# Altium project PCB_INSTRUMENTATION_VSOURCE.PrjPcb
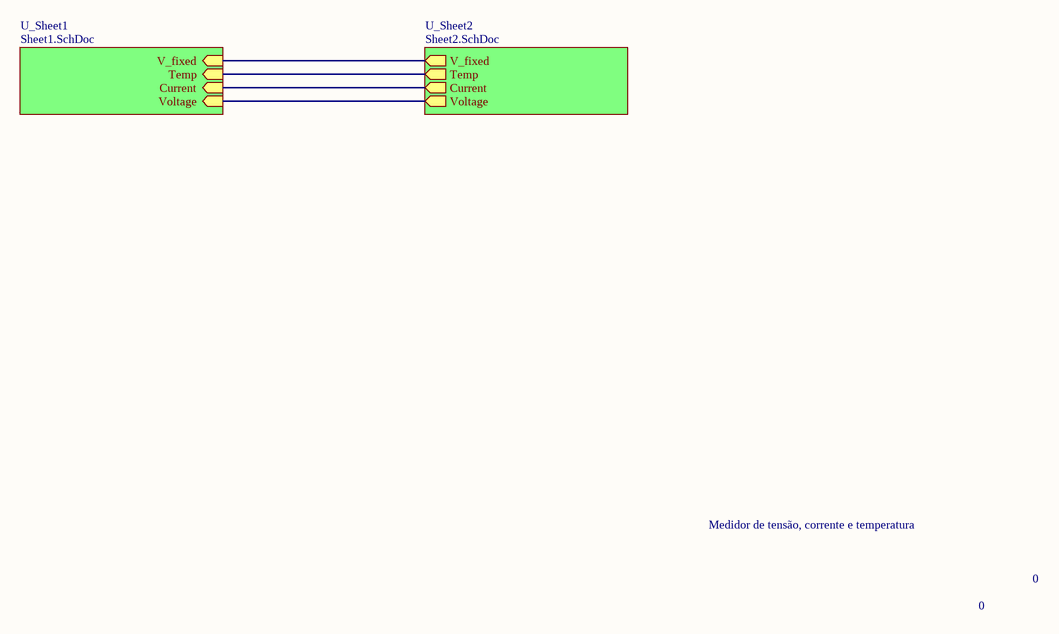
[diagram p0: main.SchDoc]
3 sheets, 53 parts. Net scope: hierarchical (ports join the sheet entries above them; power ports are global).
Board file: PCB_INST_FONTE.PcbDoc
Sheets:
  main.SchDoc
    U_Sheet1 = Sheet1.SchDoc
    U_Sheet2 = Sheet2.SchDoc

## Sheet main.SchDoc
size A4

### Sub-sheets
U_Sheet1 = Sheet1.SchDoc: V_fixed (in), Temp (in), Current (in), Voltage (in)
U_Sheet2 = Sheet2.SchDoc: V_fixed (out), Temp (out), Current (out), Voltage (out)

### Nets
NetC14_1: sheet U_Sheet1/Voltage, sheet U_Sheet2/Voltage
NetC15_1: sheet U_Sheet1/V_fixed, sheet U_Sheet2/V_fixed
NetC16_1: sheet U_Sheet1/Current, sheet U_Sheet2/Current
NetC17_1: sheet U_Sheet1/Temp, sheet U_Sheet2/Temp

### Notes on the sheet
- Medidor de tensão, corrente e temperatura
- 0

## Sheet Sheet1.SchDoc
size A4
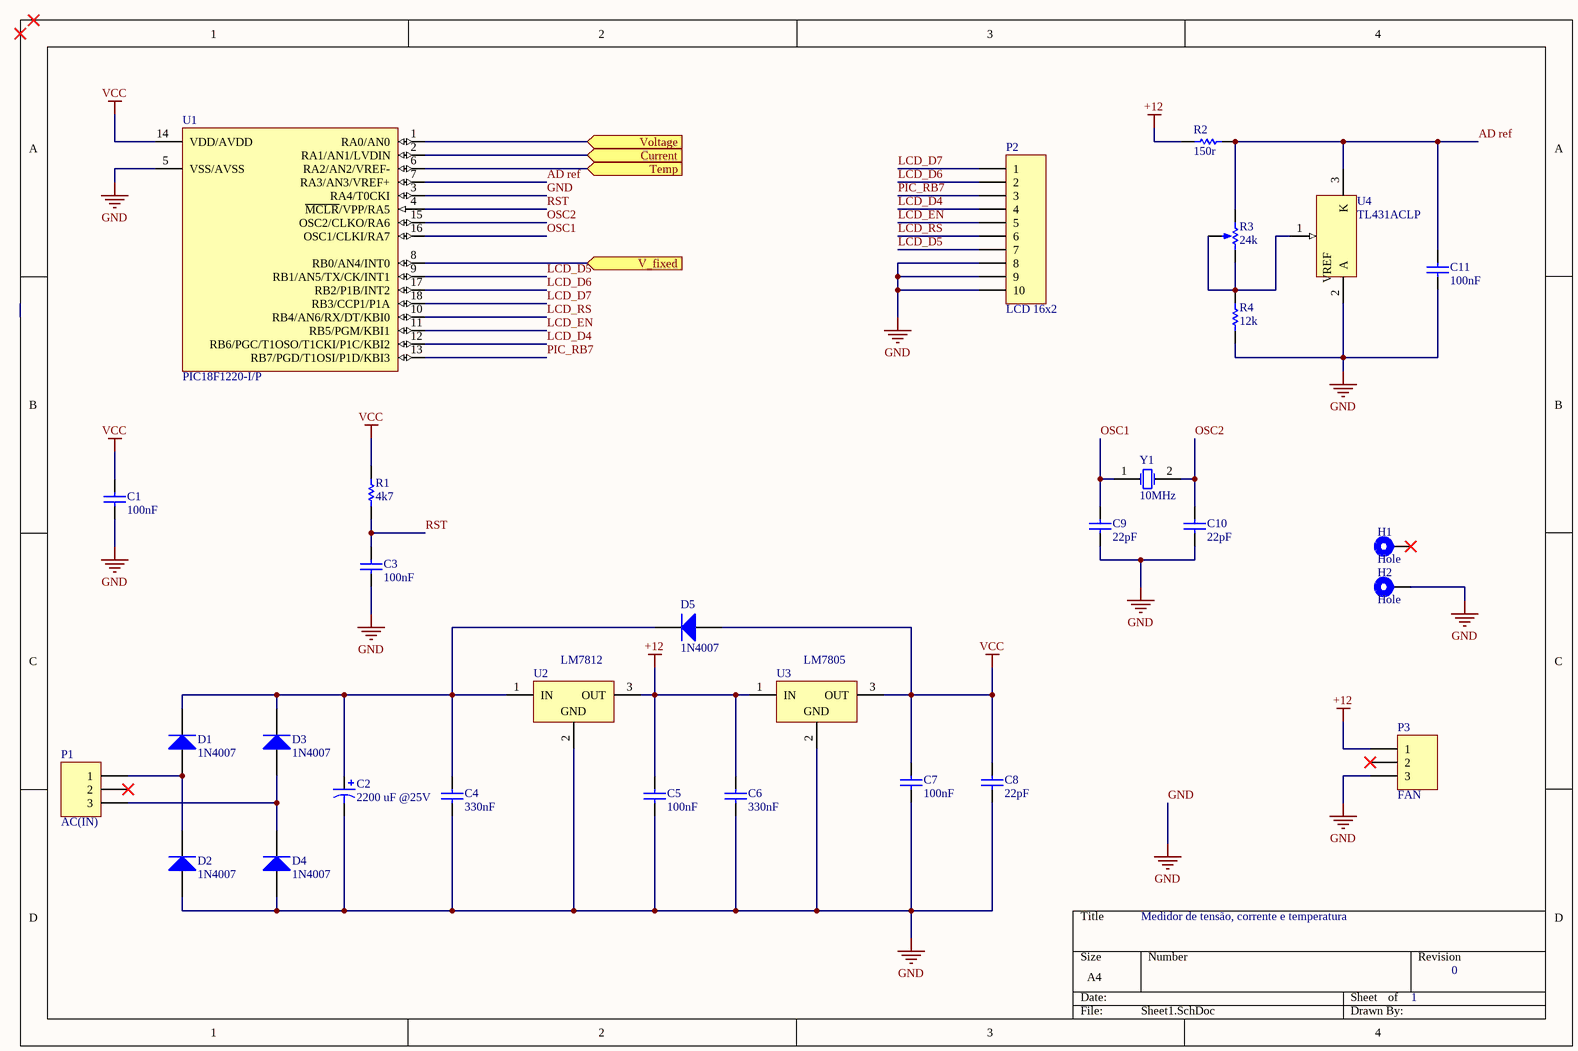
[diagram p1: Sheet1.SchDoc]

### Parts
C1  100nF  [RAD-0.2]
C2  2200 uF @25V  [CAPPR5-13x21]
C3  100nF  [RAD-0.2]
C4  330nF  [RAD-0.2]
C5  100nF  [RAD-0.2]
C6  330nF  [RAD-0.2]
C7  100nF  [RAD-0.2]
C8  22pF  [RAD-0.2]
C9  22pF  [RAD-0.2]
C10  22pF  [RAD-0.2]
C11  100nF  [RAD-0.2]
D1  1N4007  [DIODE-1N400X]
D2  1N4007  [DIODE-1N400X]
D3  1N4007  [DIODE-1N400X]
D4  1N4007  [DIODE-1N400X]
D5  1N4007  [DO-41]
H1  Hole  [HOLE_M3]
H2  Hole  [HOLE_M3]
P1  AC(IN)  [HDR1X3]
P2  LCD 16x2  [HDR1X10]
P3  FAN  [HDR1X3]
R1  4k7  [AXIAL-0.4]
R2  150r  [AXIAL-0.4]
R3  24k  [VR1]
R4  12k  [AXIAL-0.4]
U1  PIC18F1220-I/P  [PDIP300-P18]
U2  LM7812  [T03B]
U3  LM7805  [T03B]
U4  TL431ACLP  [LP03]
Y1  10MHz  [CRYSTAL-HC49S]

### Ports
Current (in), Temp (in), V_fixed (in), Voltage (in)

### Nets
+12: C5.1 C6.1 P3.1 R2.1 U2.3(OUT) U3.1(IN)
GND: C1.2 C2.2 C3.2 C4.2 C5.2 C6.2 C7.2 C8.1 C9.1 C10.1 C11.2 D2.1(A) D4.1(A) H2.1 P2.8 P2.9 P2.10 P3.3 R4.1 U1.3(RA4/T0CKI) U1.5(VSS/AVSS) U2.2(GND) U3.2(GND) U4.2(A)
VCC: C1.1 C7.1 C8.2 D5.1(A) R1.2 U1.14(VDD/AVDD) U3.3(OUT)
AD ref: C11.1 R2.2 R3.1(TOP) U1.7(RA3/AN3/VREF+) U4.3(K)
LCD_D4: P2.4 U1.12(RB6/PGC/T1OSO/T1CKI/P1C/KBI2)
LCD_D5: P2.7 U1.9(RB1/AN5/TX/CK/INT1)
LCD_D6: P2.2 U1.17(RB2/P1B/INT2)
LCD_D7: P2.1 U1.18(RB3/CCP1/P1A)
LCD_EN: P2.5 U1.11(RB5/PGM/KBI1)
LCD_RS: P2.6 U1.10(RB4/AN6/RX/DT/KBI0)
OSC1: C9.2 U1.16(OSC1/CLKI/RA7) Y1.1(OSC1)
OSC2: C10.2 U1.15(OSC2/CLKO/RA6) Y1.2(OSC2)
PIC_RB7: P2.3 U1.13(RB7/PGD/T1OSI/P1D/KBI3)
RST: C3.1 R1.1 U1.4(~{MCLR}/VPP/RA5)
NetC2_1: C2.1 C4.1 D1.2(K) D3.2(K) D5.2(K) U2.1(IN)
NetC14_1: U1.1(RA0/AN0) ; port Voltage
NetC15_1: U1.8(RB0/AN4/INT0) ; port V_fixed
NetC16_1: U1.2(RA1/AN1/LVDIN) ; port Current
NetC17_1: U1.6(RA2/AN2/VREF-) ; port Temp
NetD1_1: D1.1(A) D2.2(K) P1.1
NetD3_1: D3.1(A) D4.2(K) P1.3
NetR3_2: R3.2(BOT) R3.3(TAP) R4.2 U4.1(VREF)

Not connected (* = marked no-connect by the designer): H1 1*; P1 2*; P3 2*

### Notes on the sheet
- Medidor de tensão, corrente e temperatura
- 1
- 0

### Library data of the parts
C1 C3-C11 = C: Capacitor; Value: 1; Manufacturer: *; PartNumber: *; Package Type: *
C2 = CP: Polarized Capacitor; Manufacturer: *; PartNumber: *; Package Type: *; Value: *
D1-D4 = D: Diode; Manufacturer: *; PartNumber: *; Package Type: *
D5 = Diode 1N4007: 1 Amp General Purpose Rectifier; Published: 8-Jun-2000; LatestRevisionDate: 17-Jul-2002; LatestRevisionNote: Re-released for DXP Platform.; DatasheetVersion: 1998; PackageVersion: Aug-1999; PackageReference: DO-41; Publisher: Altium Limited; PackageDescription: Diode, Axial; Body 5.2 x 2.7 mm (LxDia. max), Lead Dia. 0.86 mm (max); Code_JEDEC: DO-204-AL; ComponentLink1Description: Manufacturer Link; ComponentLink1URL: http://www.fairchildsemi.com/; ComponentLink2Description: Datasheet; ComponentLink2URL: http://www.fairchildsemi.com/ds/1N%2F1N4001.pdf
P1 P3 = Header 3: Header, 3-Pin; LatestRevisionDate: 17-Jul-2002; LatestRevisionNote: Re-released for DXP Platform.; Publisher: Altium Limited
P2 = Header 10: Header, 10-Pin; LatestRevisionDate: 17-Jul-2002; LatestRevisionNote: Re-released for DXP Platform.; Publisher: Altium Limited
R1 R2 R4 = R: Resistor; Value: 0; Manufacturer: *; PartNumber: *; Package Type: *
R3 = R Pot: Potentiometer; Manufacturer: *; PartNumber: *; Package Type: *; Value: *; Set Position: *
U1 = PIC18F1220-I/P: High Performance, Enhanced Flash Microcontroller with 10-Bit A/D and nanoWatt Technology, 4K Flash, 18-Pin PDIP, Industrial Temperature; Published: 11-Oct-2004; LatestRevisionDate: 29-Jan-2009; LatestRevisionNote: Sch. layout revised. 3D Model Removed.; DatasheetVersion: revF, Feb-2007; PackageVersion: revBB, Aug-2009; PackageReference: PDIP300-P18; Publisher: Altium Limited; PackageDescription: 18-Lead Plastic Dual In-Line (P) - 300 mil Body [PDIP]; Supplier 1: Digi-Key; Supplier Part Number 1: PIC18F1220-I/P-ND; Supplier 2: Farnell; Supplier Part Number 2: 9761977; Supplier 3: Farnell; Supplier Part Number 3: 9771450; Code_JEDEC: MS-001; ComponentLink1Description: Datasheet; ComponentLink1URL: http://ww1.microchip.com/downloads/en/DeviceDoc/39605F.pdf; ComponentLink2Description: Packaging Specification; ComponentLink2URL: http://www.microchip.com/stellent/groups/techpub_sg/documents/packagingspec/en012702.pdf; ComponentLink3Description: Microchip.com Home; ComponentLink3URL: http://www.microchip.com/
U2 U3 = LM7808CT: Series 3-Terminal Positive Regulators, 3-pin TO-220; Manufacturer: National Semiconductor; PackageTopMarking: NSUZXYTTE#*LM7808CT; CompType: LDO IC; Published: 4-Dec-2008; DatasheetVersion: Jul-2006; PackageVersion: revL, Jan-1992; PackageReference: T03B; Publisher: Altium Limited; PackageDescription: TO-220, Molded, 3 Lead, Straight; Supplier 1: Farnell; Supplier Part Number 1: 9490248; PartNumber: LM7808CT; RoHS: O; PinCount: 3; ComponentLink1Description: LM340 Datasheet; ComponentLink1URL: http://www.national.com/ds/LM/LM340.pdf; ComponentLink2Description: LM340 Web Page; ComponentLink2URL: http://www.national.com/pf/LM/LM340.html; ComponentLink3Description: T03B Package Page; ComponentLink3URL: http://www.national.com/packaging/folders/t03b.html
U4 = TL431ACLP: Adjustable Precision Shunt Regulator; Published: 15-Apr-2002; LatestRevisionDate: 06-Jun-2005; LatestRevisionNote: Sch pins 1 & 3 swapped; DatasheetVersion: Oct-2000; PackageVersion: Nov-2001; PackageReference: LP03; Publisher: Altium Limited; PackageDescription: TO, Flat Index; 3 In-Line, Axial Leads; Body Dia. 4.8mm; Leads 0.56 x 0.41 mm (max); Code_JEDEC: TO-226-AA; ComponentLink1Description: Manufacturer Link; ComponentLink1URL: http://www.ti.com/; ComponentLink2Description: Datasheet; ComponentLink2URL: http://www-s.ti.com/sc/ds/tl431a.pdf
Y1 = XTAL: Crystal Oscillator; Manufacturer: *; PartNumber: *; Package Type: *

## Sheet Sheet2.SchDoc
size A4
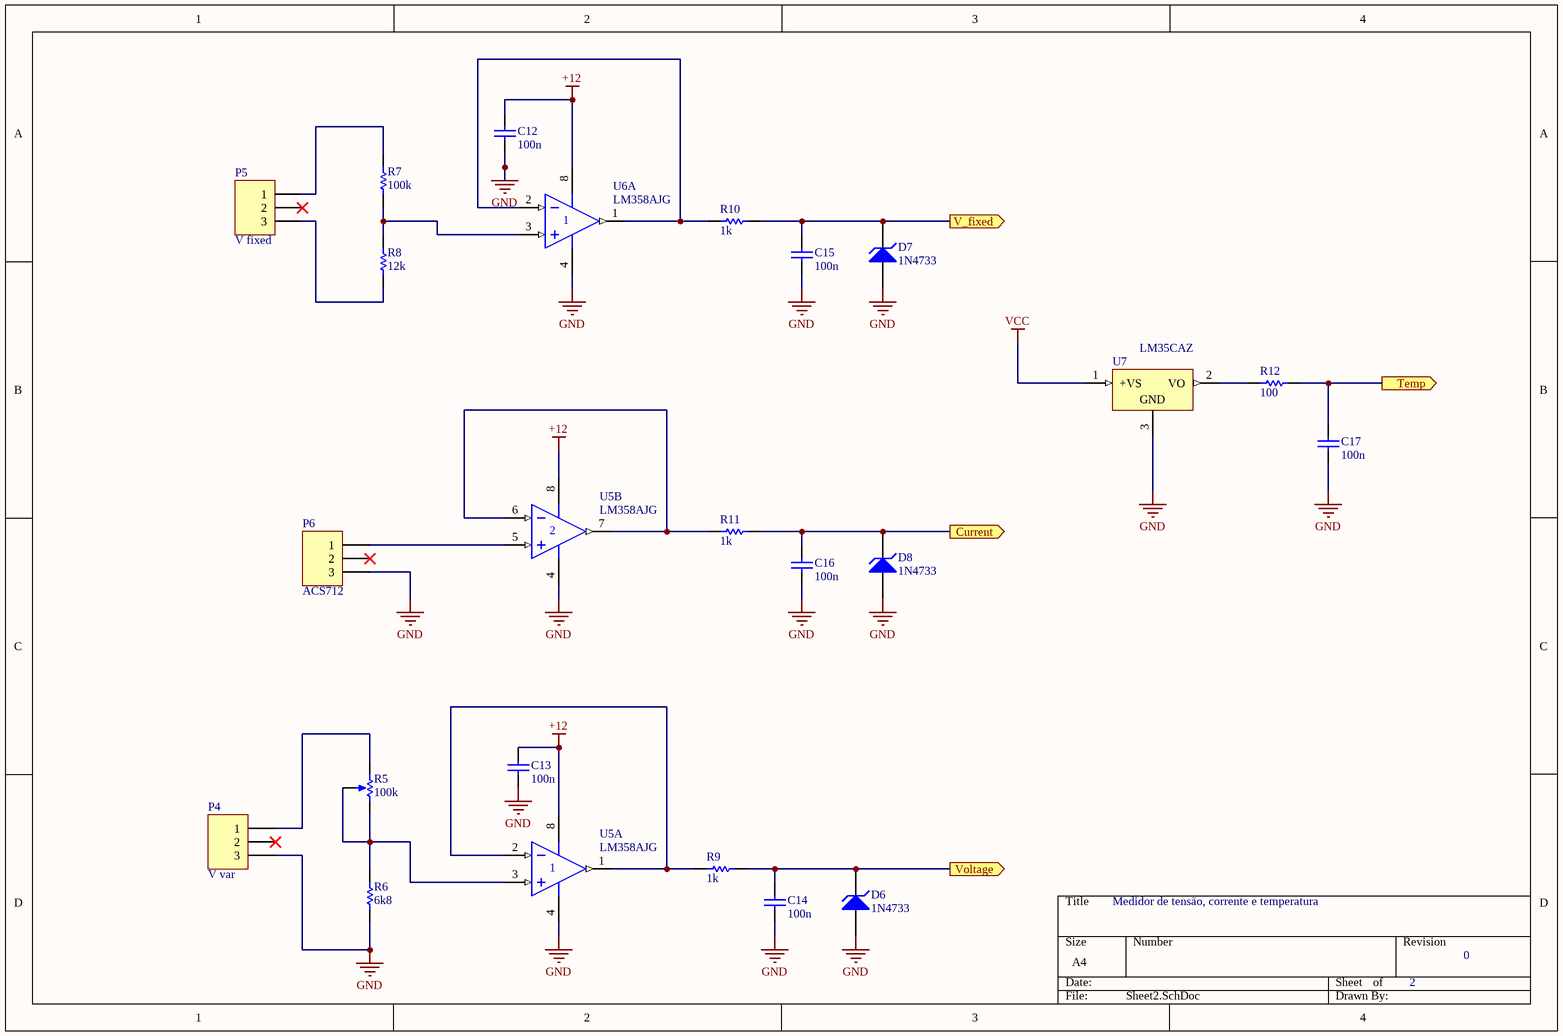
[diagram p2: Sheet2.SchDoc]

### Parts
C12  100n  [RAD-0.2]
C13  100n  [RAD-0.2]
C14  100n  [RAD-0.2]
C15  100n  [RAD-0.2]
C16  100n  [RAD-0.2]
C17  100n  [RAD-0.2]
D6  1N4733  [DIODE-SIGNAL]
D7  1N4733  [DIODE-SIGNAL]
D8  1N4733  [DIODE-SIGNAL]
P4  V var  [HDR1X3]
P5  V fixed  [HDR1X3]
P6  ACS712  [HDR1X3]
R5  100k  [VR1]
R6  6k8  [AXIAL-0.4]
R7  100k  [AXIAL-0.4]
R8  12k  [AXIAL-0.4]
R9  1k  [AXIAL-0.4]
R10  1k  [AXIAL-0.4]
R11  1k  [AXIAL-0.4]
R12  100  [AXIAL-0.4]
U5  LM358AJG  [JG008]  (parts A,B of 2)
U6  LM358AJG  [JG008]  (part A of 2)
U7  LM35CAZ  [Z03A]

### Ports
Current (out), Temp (out), V_fixed (out), Voltage (out)

### Nets
+12: C12.1 C13.1 U5.8(V+) U6.8(V+)
GND: C12.2 C13.2 C14.2 C15.2 C16.2 C17.2 D6.1(A) D7.1(A) D8.1(A) P4.3 P6.3 R6.1 U5.4(V-) U6.4(V-) U7.3(GND)
VCC: U7.1(+VS)
NetC14_1: C14.1 D6.2(K) R9.2 ; port Voltage
NetC15_1: C15.1 D7.2(K) R10.2 ; port V_fixed
NetC16_1: C16.1 D8.2(K) R11.2 ; port Current
NetC17_1: C17.1 R12.2 ; port Temp
NetP4_1: P4.1 R5.1(TOP)
NetP5_1: P5.1 R7.2
NetP5_3: P5.3 R8.1
NetP6_1: P6.1 U5.5(IN+)
NetR5_2: R5.2(BOT) R5.3(TAP) R6.2 U5.3(IN+)
NetR7_1: R7.1 R8.2 U6.3(IN+)
NetR9_1: R9.1 U5.1(OUT) U5.2(IN-)
NetR10_1: R10.1 U6.1(OUT) U6.2(IN-)
NetR11_1: R11.1 U5.6(IN-) U5.7(OUT)
NetR12_1: R12.1 U7.2(VO)

Not connected (* = marked no-connect by the designer): P4 2*; P5 2*; P6 2*

### Notes on the sheet
- Medidor de tensão, corrente e temperatura
- 2
- 0

### Library data of the parts
C12-C17 = C: Capacitor; Value: 1; Manufacturer: *; PartNumber: *; Package Type: *
D6-D8 = D Zener: Zener Diode; Manufacturer: *; PartNumber: *; Package Type: *
P4-P6 = Header 3: Header, 3-Pin; LatestRevisionDate: 17-Jul-2002; LatestRevisionNote: Re-released for DXP Platform.; Publisher: Altium Limited
R5 = R Pot: Potentiometer; Manufacturer: *; PartNumber: *; Package Type: *; Value: *; Set Position: *
R6-R12 = R: Resistor; Value: 0; Manufacturer: *; PartNumber: *; Package Type: *
U5 U6 = LM358AJG: Dual Operational Amplifier; Published: 15-Apr-2002; LatestRevisionDate: 04-Mar-2005; LatestRevisionNote: Stylized 3D Model Added.; DatasheetVersion: Aug-1988; PackageVersion: Jan-1995; PackageReference: JG008; Publisher: Altium Limited; PackageDescription: DIP; 8 Leads; Row Spacing 7.62 mm; Pitch 2.54 mm; ComponentLink1Description: Manufacturer Link; ComponentLink1URL: http://www.ti.com/
U7 = LM35CAZ: Precision Centigrade Temperature Sensor, 3-pin TO-92; Manufacturer: National Semiconductor; PackageTopMarking: NSXYTT*LM35*CAZ; PowerWise: N; CompType: Temp Sensor IC; Published: 4-Dec-2008; LatestRevisionDate: 15-Jul-2009; LatestRevisionNote: Sch pins 1 & 3 reversed.; DatasheetVersion: Nov-2000; PackageVersion: revG, Sep-2000; PackageReference: Z03A; Publisher: Altium Limited; PackageDescription: TO-92, Molded, 3 Lead; Supplier 1: Farnell; Supplier Part Number 1: 9494529; PartNumber: LM35CAZ; RoHS: N; PinCount: 3; Code_JEDEC: TO-226-AA; ComponentLink1Description: LM35 Datasheet; ComponentLink1URL: http://www.national.com/ds/LM/LM35.pdf; ComponentLink2Description: LM35 Web Page; ComponentLink2URL: http://www.national.com/pf/LM/LM35.html; ComponentLink3Description: Z03A Package Page; ComponentLink3URL: http://www.national.com/packaging/folders/z03a.html

## Nets that join several sheets
+12: Sheet1 (6 pins), Sheet2 (C12.1 C13.1 U5.8 U6.8)
GND: Sheet1 (24 pins), Sheet2 (15 pins)
VCC: Sheet1 (7 pins), Sheet2 (U7.1)
NetC14_1: Sheet1 (U1.1), Sheet2 (C14.1 D6.2 R9.2)
NetC15_1: Sheet1 (U1.8), Sheet2 (C15.1 D7.2 R10.2)
NetC16_1: Sheet1 (U1.2), Sheet2 (C16.1 D8.2 R11.2)
NetC17_1: Sheet1 (U1.6), Sheet2 (C17.1 R12.2)